# Altium schematic sheet Sheet2.SchDoc
size A4
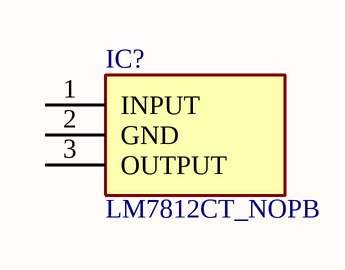
[diagram p0: Sheet2.SchDoc]

## Parts
IC?  LM7812CT_NOPB  [TO254P470X1028X1955-3P]

## Nets

Not connected (* = marked no-connect by the designer): IC? 1(INPUT) 2(GND) 3(OUTPUT)

## Library data of the parts
IC? = LM7812CT_NOPB: Integrated Circuit; Manufacturer_Name: Texas Instruments; Manufacturer_Part_Number: LM7812CT/NOPB; Datasheet Link: http://www.ti.com/lit/ds/symlink/lm340.pdf; Height: 4.7mm; Mouser2 Part Number: 926-LM7812CT/NOPB; Mouser2 Price/Stock: https://www.mouser.com/Search/Refine.aspx?Keyword=926-LM7812CT%2FNOPB